# Altium schematic sheet ECUv2.SchDoc
size A; SheetNumber: 1; SheetTotal: 1
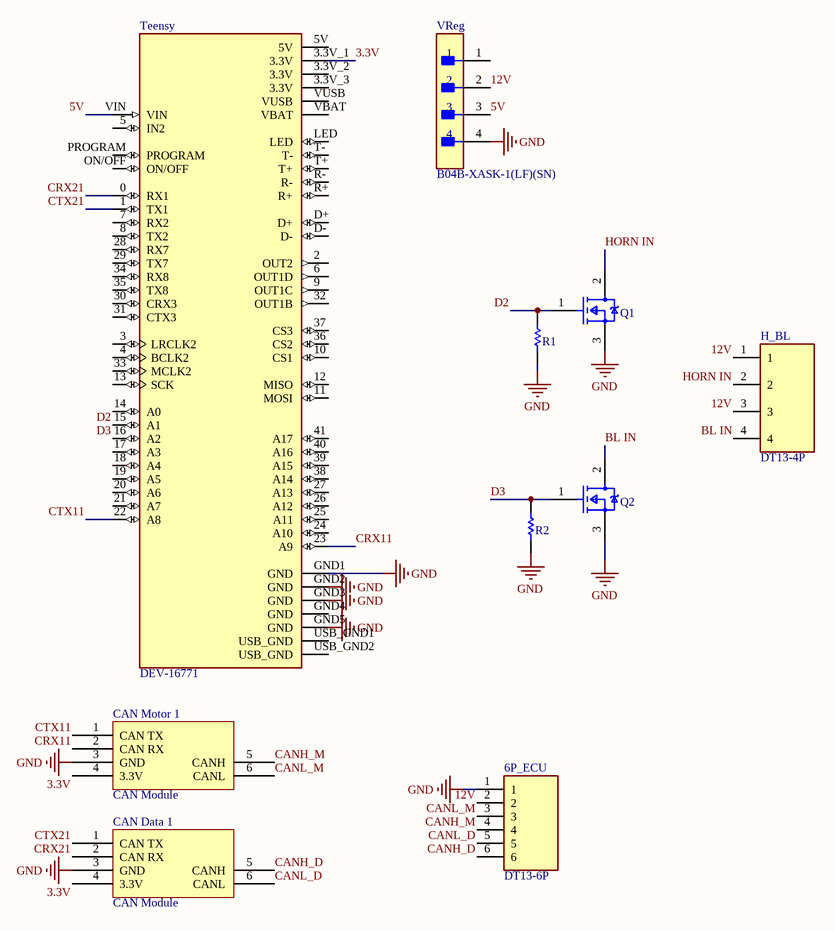
[diagram p0: ECUv2.SchDoc]

## Parts
6P_ECU  DT13-6P  [TE_DT13-6P]
CAN_Data_1  CAN Module  [CAN Module-Footprint-1]
CAN_Motor_1  CAN Module  [CAN Module-Footprint-1]
H_BL  DT13-4P  [TE_DT13-4P]
Q1  IRLZ44NPbF  [FP-PG-TO220-3-MFG]  (value not drawn)
Q2  IRLZ44NPbF  [FP-PG-TO220-3-MFG]  (value not drawn)
R1  MFR-25FBF5210K  [RESA60-630X240]  (value not drawn)
R2  MFR-25FBF5210K  [RESA60-630X240]  (value not drawn)
Teensy  DEV-16771  [MODULE_DEV-16771]
VReg  B04B-XASK-1(LF)(SN)  [FP-B04B-XASK-1_LF_SN-MFG]

## Nets
GND: 6P_ECU.1 CAN_Data_1.3(GND) CAN_Motor_1.3(GND) Q1.3(S) Q2.3(S) R1.1 R2.1 Teensy.GND1(GND) Teensy.GND2(GND) Teensy.GND3(GND) Teensy.GND5(GND) VReg.4
3.3V: CAN_Data_1.4(3.3V) CAN_Motor_1.4(3.3V) Teensy.3.3V_1(3.3V)
5V: Teensy.VIN VReg.3
12V: 6P_ECU.2 H_BL.1 H_BL.3 VReg.2
BL IN: H_BL.4 Q2.2(D)
CANH_D: 6P_ECU.6 CAN_Data_1.5(CANH)
CANH_M: 6P_ECU.4 CAN_Motor_1.5(CANH)
CANL_D: 6P_ECU.5 CAN_Data_1.6(CANL)
CANL_M: 6P_ECU.3 CAN_Motor_1.6(CANL)
CRX11: CAN_Motor_1.2(CAN_RX) Teensy.23(A9)
CRX21: CAN_Data_1.2(CAN_RX) Teensy.0(RX1)
CTX11: CAN_Motor_1.1(CAN_TX) Teensy.22(A8)
CTX21: CAN_Data_1.1(CAN_TX) Teensy.1(TX1)
D2: Q1.1(G) R1.2 Teensy.15(A1)
D3: Q2.1(G) R2.2 Teensy.16(A2)
HORN IN: H_BL.2 Q1.2(D)

Not connected (* = marked no-connect by the designer): Teensy 2(OUT2) 3(LRCLK2) 3.3V_2(3.3V) 3.3V_3(3.3V) 4(BCLK2) 5(IN2) 5V 6(OUT1D) 7(RX2) 8(TX2) 9(OUT1C) 10(CS1) 11(MOSI) 12(MISO) 13(SCK) 14(A0) 17(A3) 18(A4) 19(A5) 20(A6) 21(A7) 24(A10) 25(A11) 26(A12) 27(A13) 28(RX7) 29(TX7) 30(CRX3) 31(CTX3) 32(OUT1B) 33(MCLK2) 34(RX8) 35(TX8) 36(CS2) 37(CS3) 38(A14) 39(A15) 40(A16) 41(A17) D+ D- GND4(GND) LED ON/OFF PROGRAM R+ R- T+ T- USB_GND1(USB_GND) USB_GND2(USB_GND) VBAT VUSB; VReg 1

## Library data of the parts
6P_ECU = DT13-6P: DT13 Series, 4.44mm Pitch 6 Way 2 Row Right Angle PCB Header, Solder Termination; MF: TE Connectivity; DigiKey-Purchase-URL: https://snapeda.com/shop?store=DigiKey&id=1897474; Value: *; SnapEDA_Link: https://www.snapeda.com/parts/DT13-6P/TE%20Connectivity%20Deutsch%20Connectors/view-part/1897474/?ref=snap; EU_RoHS_Compliance: Compliant; Availability: Unavailable; Price: None; Package: None; MP: DT13-6P
CAN_Data_1 CAN_Motor_1 = CMP-00030-00003-1: CAN waveshare
H_BL = DT13-4P: DT13 Series, 4.44mm Pitch 4 Way 2 Row Right Angle PCB Header, Solder Termination; MF: TE Connectivity; SnapEDA_Link: https://www.snapeda.com/parts/DT13-4P/TE%20Connectivity%20Deutsch%20Connectors/view-part/2708791/?ref=snap; MP: DT13-4P; TE_purchase_URL: https://www.te.com/usa-en/product-DT13-4P.html?te_bu=Cor&te_type=disp&te_campaign=seda_glo_cor-seda-global-disp-prtnr-fy19-seda-model-bom-cta_sma-317_1&elqCampaignId=32493; Availability: Unavailable; Value: *; Price: None; Package: None
Q1 Q2 = CMP-32901-000488-1: MOSFET N-CH 55V 47A TO220AB; Turn-On Delay Time: 11ns; Gate to Source Voltage (Vgs): 16V; Element Configuration: Single; Rds On Max: 22mR; Turn-Off Delay Time: 26ns; Max Power Dissipation: 110W; Threshold Voltage: 2V; Drain to Source Resistance: 35mR; Input Capacitance: 1.7nF; Continuous Drain Current (ID): 47A; Case/Package: TO-220; Lead Free: Lead Free; Halogen Free: Halogen Free; Packaging: Rail/Tube; Length: 0.414inch; Min Operating Temperature: -55°C; REACH SVHC: No SVHC; Number of Pins: 3; Width: 0.185inch; Drain to Source Voltage (Vdss): 55V; Power Dissipation: 110W; RoHS Compliant: Yes; Max Operating Temperature: 175°C; Height: 0.6inch; Max Dual Supply Voltage: 55V; Drain to Source Breakdown Voltage: 55V; Mount: Through Hole
R1 R2 = CMP-1659-00074-2: Axial Resistor, 10 KOhm, +/- 1%, 0.25 W, -55 to 155 degC, 2-Pin THD, RoHS, Bulk; Manufacturer: Yageo; Temperature Coefficient: 100ppm\/degreesC; Voltage Rating: 250V; Voltage Rating (DC): 200V; Resistance: 10KOhm; Max Power Dissipation: 250mW; Datasheet URL: http://www.yageo.com/documents/recent/Yageo%20LR_MFR_2013.pdf; Packaging: Bulk; RoHSCompliant: True; Mount: ThroughHole; Package Reference: MFR-25; Termination: Axial; Composition: MetalFilm; Number of Terminations: 2; Package Quantity: 200; Mounting Technology: ThroughHole; Length: 0.248inch; Max Operating Temperature: 155degC; Min Operating Temperature: -55degC; Datasheet Version: 04/2013; Lead Free: LeadFree; Manufacturer URL: http://www.yageo.com/; Tolerance: 1%; Power Rating: 250mW; Package Description: 2-Pin Axial Lead, Dia 2.4 mm, Body Length 6.3 mm; Military Standard: Not; Case\/Package: Axial
Teensy = DEV-16771: RT1062 Teensy 4.1 series ARM® Cortex®-M7 MPU Embedded Evaluation Board; MF: SparkFun Electronics; SnapEDA_Link: https://www.snapeda.com/parts/DEV-16771/SparkFun+Electronics/view-part/?ref=snap; Package: None; Value: *; MP: DEV-16771; Check_prices: https://www.snapeda.com/parts/DEV-16771/SparkFun+Electronics/view-part/?ref=eda
VReg = CMP-17439-000018-1: CONN HEADER VERT 4POS 2.5MM; Manufacturer: JST; Current Rating: 3A; Voltage Rating: 250V; Conn Orientation: Straight; Conn Gender: Male; Number Of Contacts: 4; ComponentLink2Description: Datasheet; Package: B04B-XASK-1(LF)(SN); Octopart: https://octopart.com/b04b-xask-1%28lf%29%28sn%29-jst-3990149; Pitch: 2.5mm; Device Class L1: Connectors; RoHS: TRUE; Device Class L3: unset; Manufacturer Part Number: B04B-XASK-1(LF)(SN); Temperature Range High: +85°C; Height: 8.8mm; Lead Free: Yes; Category: Conn; Temperature: -25°C to +85°C; Digikey Description: CONN HEADER VERT 4POS 2.5MM; Temperature Range Low: -25°C; ComponentLink2URL: http://www.jst-mfg.com/product/pdf/eng/eXA1.pdf; Contact Material: Tin,Copper; Device Class L2: Headers and Wire Housings; Automotive: No; Number Of Rows: 1